# Altium schematic sheet Mixer.SchDoc
size A3
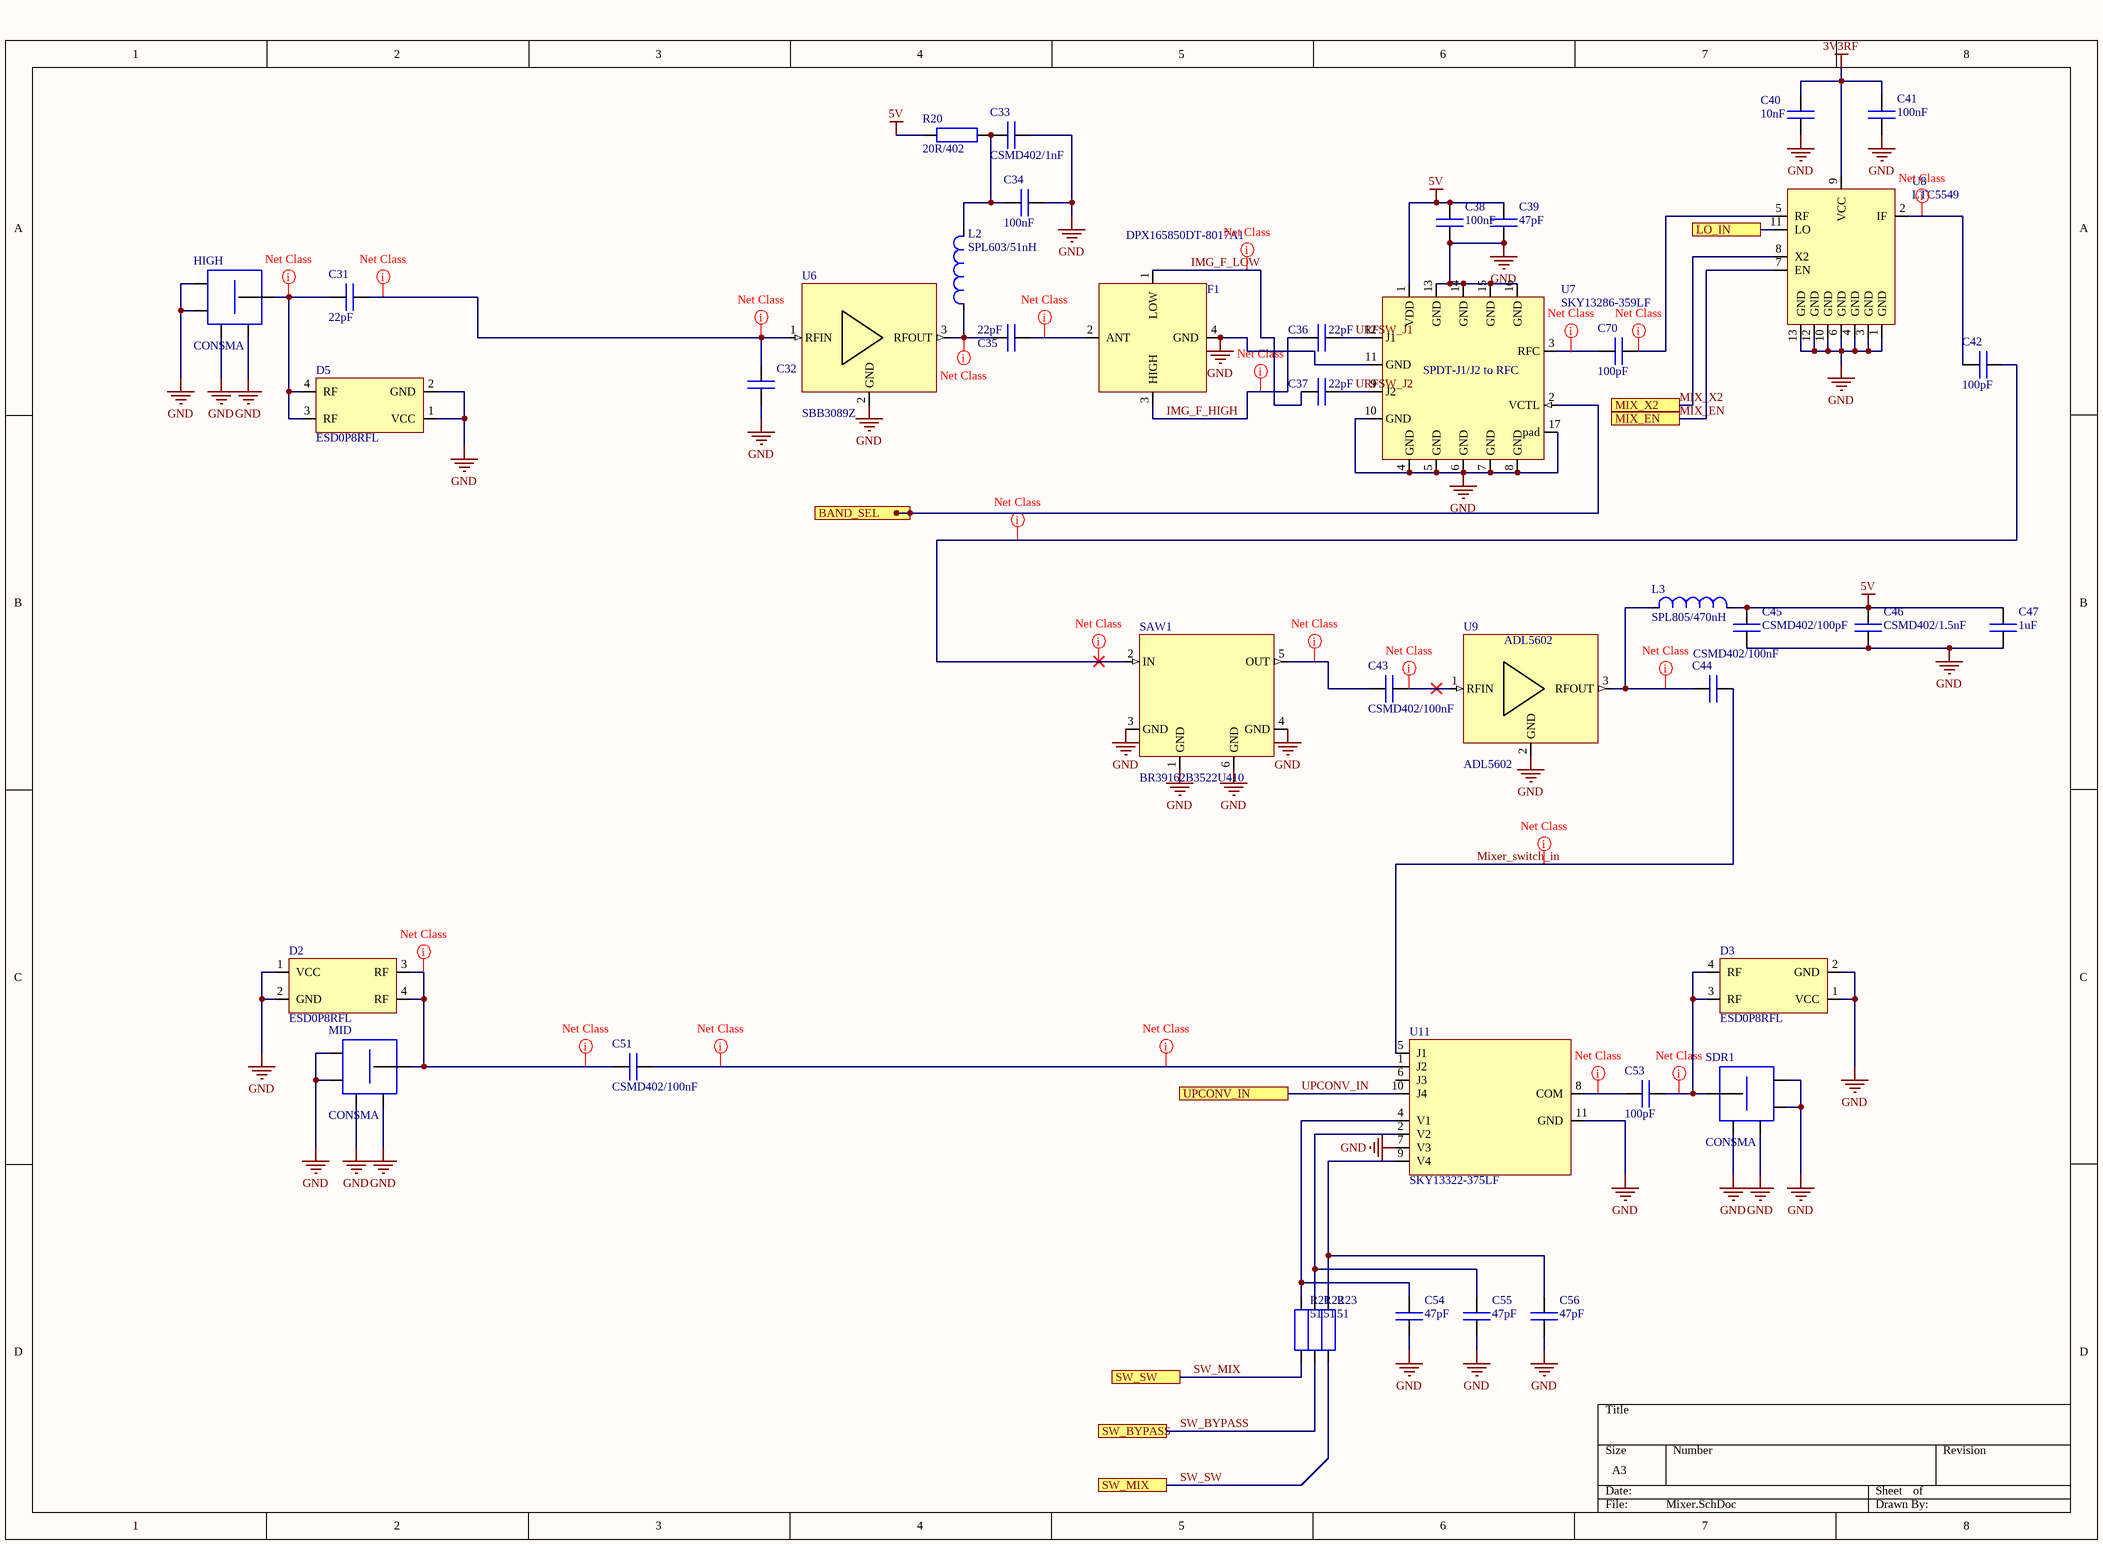
[diagram p0: Mixer.SchDoc]

## Parts
C31  22pF  [smd C0402]
C32  (no value)  [smd C0402]
C33  CSMD402/1nF  [smd C0402]
C34  100nF  [smd C0402]
C35  22pF  [smd C0402]
C36  22pF  [smd C0402]
C37  22pF  [smd C0402]
C38  100nF  [smd C0402]
C39  47pF  [smd C0402]
C40  10nF  [smd C0402]
C41  100nF  [smd C0402]
C42  100pF  [smd C0402]
C43  CSMD402/100nF  [smd C0402]
C44  CSMD402/100nF  [smd C0402]
C45  CSMD402/100pF  [smd C0402]
C46  CSMD402/1.5nF  [smd C0402]
C47  1uF  [smd C0603_0.80]
C51  CSMD402/100nF  [smd C0402]
C53  100pF  [smd C0402]
C54  47pF  [smd C0402]
C55  47pF  [smd C0402]
C56  47pF  [smd C0402]
C70  100pF  [smd C0402]
D2  ESD0P8RFL  [ESD0P8RFL]
D3  ESD0P8RFL  [ESD0P8RFL]
D5  ESD0P8RFL  [ESD0P8RFL]
F1  DPX165850DT-8017A1  [DPX165850DT-8017A1]
HIGH  CONSMA  [con SMA (recht)]
L2  SPL603/51nH  [smd C0603]
L3  SPL805/470nH  [smd C0805]
MID  CONSMA  [con SMA (recht)]
R20  20R/402  [smd C0402_0.35]
R21  51  [smd C0402_0.35]
R22  51  [smd C0402_0.35]
R23  51  [smd C0402_0.35]
SAW1  BR39162B3522U410  [SAW_package]
SDR1  CONSMA  [con SMA (recht)]
U6  SBB3089Z  [LFCSP]
U7  SKY13286-359LF  [QFN-16_skyworks]
U8  LTC5549  [LTC5549]
U9  ADL5602  [LFCSP]
U11  SKY13322-375LF  [QFN50P200X300X80-10N]

## Ports
BAND_SEL (in), LO_IN, MIX_EN, MIX_X2, SW_BYPASS, SW_MIX, SW_SW, UPCONV_IN

## Nets
3V3RF: C40.2 C41.2 U8.9(VCC)
5V: C38.2 C39.2 C45.1 C46.1 C47.2 L3.2 R20.1 U7.1(VDD)
GND: C32.1 C33.2 C34.1 C38.1 C39.1 C40.1 C41.1 C45.2 C46.2 C47.1 C54.1 C55.1 C56.1 D2.1(VCC) D2.2(GND) D3.1(VCC) D3.2(GND) D5.1(VCC) D5.2(GND) F1.4(GND) HIGH.2 HIGH.3 HIGH.4 HIGH.5 MID.2 MID.3 MID.4 MID.5 SAW1.1(GND) SAW1.3(GND) SAW1.4(GND) SAW1.6(GND) SDR1.2 SDR1.3 SDR1.4 SDR1.5 U6.2(GND) U7.4(GND) U7.5(GND) U7.6(GND) U7.7(GND) U7.8(GND) U7.10(GND) U7.11(GND) U7.13(GND) U7.14(GND) U7.15(GND) U7.16(GND) U7.17(pad) U8.1(GND) U8.3(GND) U8.4(GND) U8.6(GND) U8.10(GND) U8.12(GND) U8.13(GND) U9.2(GND) U11.7(V3) U11.11(GND)
BAND_SEL: U7.2(VCTL) ; port BAND_SEL
IMG_F_HIGH: C36.1 F1.3(HIGH)
IMG_F_LOW: C37.1 F1.1(LOW)
LO_IN: U8.11(LO) ; port LO_IN
MIX_EN: U8.7(EN) ; port MIX_EN
MIX_X2: U8.8(X2) ; port MIX_X2
Mixer_switch_in: C44.2 U11.5(J1)
SW_BYPASS: R22.1 ; port SW_BYPASS
SW_MIX: R21.1 ; port SW_SW
SW_SW: R23.1 ; port SW_MIX
UPCONV_IN: U11.10(J4) ; port UPCONV_IN
URFSW_J1: C36.2 U7.12(J1)
URFSW_J2: C37.2 U7.9(J2)
NetC31_1: C31.1 C32.2 U6.1(RFIN)
NetC31_2: C31.2 D5.3(RF) D5.4(RF) HIGH.1
NetC33_1: C33.1 C34.2 L2.2 R20.2
NetC35_1: C35.1 L2.1 U6.3(RFOUT)
NetC35_2: C35.2 F1.2(ANT)
NetC42_1: C42.1 U8.2(IF)
NetC42_2: C42.2 SAW1.2(IN)
NetC43_1: C43.1 SAW1.5(OUT)
NetC43_2: C43.2 U9.1(RFIN)
NetC44_1: C44.1 L3.1 U9.3(RFOUT)
NetC51_1: C51.1 D2.3(RF) D2.4(RF) MID.1
NetC51_2: C51.2 U11.1(J2)
NetC53_1: C53.1 U11.8(COM)
NetC53_2: C53.2 D3.3(RF) D3.4(RF) SDR1.1
NetC54_2: C54.2 R21.2 U11.4(V1)
NetC55_2: C55.2 R22.2 U11.2(V2)
NetC56_2: C56.2 R23.2 U11.9(V4)
NetC70_1: C70.1 U7.3(RFC)
NetC70_2: C70.2 U8.5(RF)

Not connected (* = marked no-connect by the designer): U11 6(J3)

## Layout directives
net class RF: IMG_F_HIGH, IMG_F_LOW, Mixer_switch_in, NetC31_1, NetC31_2, NetC35_1, NetC35_2, NetC42_1, NetC42_2, NetC43_1, NetC43_2, NetC44_1, NetC51_1, NetC51_2, NetC53_1, NetC53_2, NetC70_1, NetC70_2

## Notes on the sheet
- (in symbol SKY13286-359LF) SPDT-J1/J2 to RFC

## Library data of the parts
C31 C35-C37 = CSMD402/22pF: smd capaciteit, verp.0402, 22pF; Part Number: CSMD402/22pF; Component Kind: Standard; Component Type: Standard; Designator: CSMD402/22pF; Pin Count: 2; Supplier 1: Farnell
C32 = CSMD402/1pF: smd capaciteit, verp.0402, 1pF; Part Number: CSMD402/100nF; Component Kind: Standard; Component Type: Standard; Library Reference: CSMD402/100nF; Pin Count: 2; Supplier 1: Farnell
C33 = CSMD402/1nF: smd capaciteit, verp.0402, 1nF; Part Number: CSMD402/1nF; Component Kind: Standard; Component Type: Standard; Designator: CSMD402/1nF; Pin Count: 2; Supplier 1: Farnell
C34 C38 C41 C43 C44 C51 = CSMD402/100nF: smd capaciteit, verp.0402, 100nF; Part Number: CSMD402/100nF; Component Kind: Standard; Component Type: Standard; Pin Count: 2; Supplier 1: Farnell
  C43 C44 C51: Designator: CSMD402/100nF
C39 = CSMD402/47pF: smd capaciteit, verp.0402, 47pF; Part Number: CSMD402/47pF; Component Kind: Standard; Component Type: Standard; Pin Count: 2; Supplier 1: Farnell
C40 = CSMD402/100nF: smd capaciteit, verp.0402, 10nF; Part Number: CSMD402/100nF; Component Kind: Standard; Component Type: Standard; Designator: CSMD402/100nF; Pin Count: 2; Supplier 1: Farnell
C42 C45 C53-C56 C70 = CSMD402/100pF: smd capaciteit, verp.0402, 100pF; Part Number: CSMD402/100pF; Component Kind: Standard; Component Type: Standard; Pin Count: 2; Supplier 1: Farnell
  C45: Designator: CSMD402/100pF
C46 = CSMD402/1.5nF: smd capaciteit, verp.0402, 1.5nF; Part Number: CSMD402/1.5nF; Component Kind: Standard; Component Type: Standard; Designator: CSMD402/1.5nF; Pin Count: 2; Supplier 1: Farnell
C47 = CSMD603/1uF: smd capaciteit, verp.0603, 1uF; Part Number: CSMD603/18nF; Component Kind: Standard; Component Type: Standard; Designator: CSMD603/18nF; Library Reference: CSMD603/18nF; Pin Count: 2; Supplier 1: Farnell
HIGH MID SDR1 = CON SMA: SMA connector, rechtop; Part Number: CON SMA; Component Kind: Standard; Component Type: Standard; Designator: CON SMA; Pin Count: 5; Supplier 1: Farnell
L3 = SPL805/470nH: smd spoel, verpakking 805, 470nH; Component Kind: Standard; Supplier 1: Farnell
R20 = 20R/402: weerstand SMD402, 20R; Supplier 1: Farnell
R21-R23 = 51R/402: weerstand SMD402, 51R; Supplier 1: Farnell
SAW1 = BR39162B3522U410: Saw Filter; Manufacturer part number: B39162B3522U410; Manufacturer: TDK
U6 = SBB3089Z: RF Amplifier; Manufacturer: rfmd/Qorvo; MPN: SBB3089ZSR
U7 = SKY13286-359LF: SPDT-J2/J1 to RFC; Manufacturer: Skyworks
U9 = ADL5602: Gain block; Manufacturer part number: ADL5602ARKZ-R7; Manufacturer: Analog Devices
L2 = SPL603/51nH: Component Kind: Standard; Supplier 1: Farnell